# Altium schematic sheet GPRSshield v1.4_1.SchDoc
size 291 x 204 mm
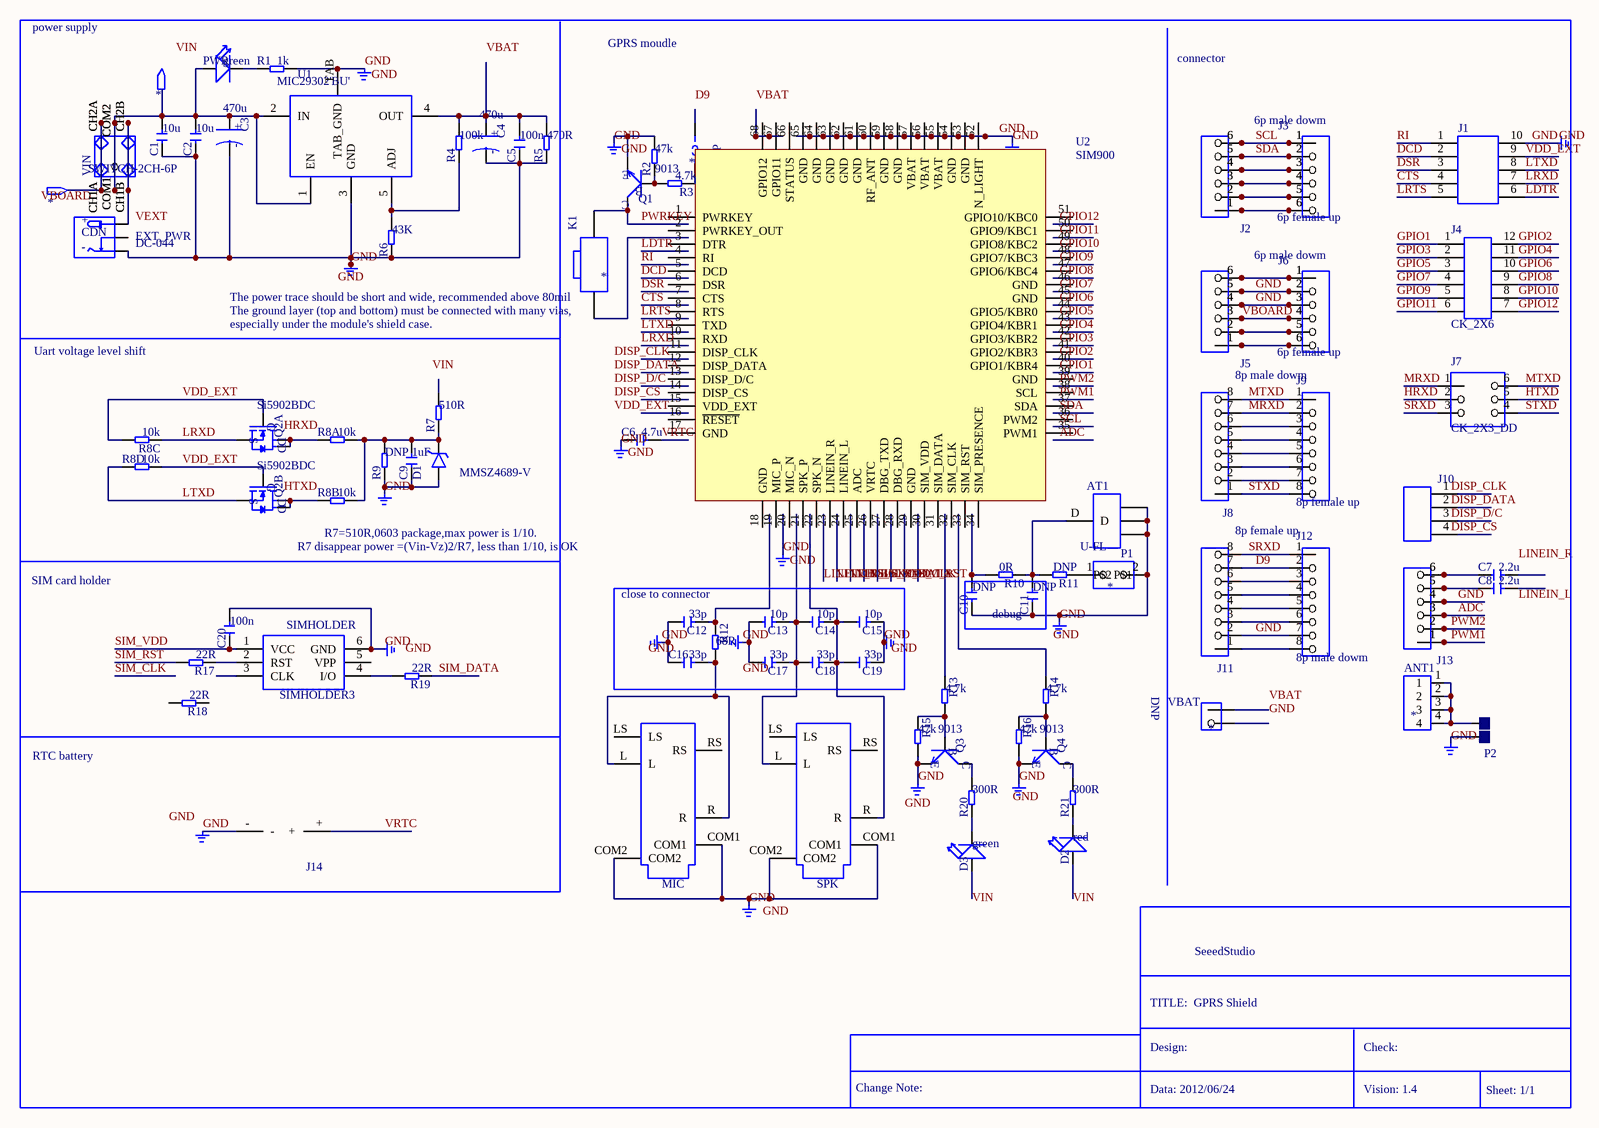
[diagram p0: GPRSshield v1.4_1.SchDoc]

## Parts
ANT1  *  [SMA-TO-IPX]
AT1  U-FL  [4P-U-FL]
C1  10u  [0603]
C2  10u  [0603]
C3  470u  [AVX_D]
C4  470u  [AVX_D]
C5  100n  [0603]
C6  4.7u  [0805]
C7  2.2u  [0603]
C8  2.2u  [0603]
C9  1uF  [0603]
C10  DNP  [0402]
C11  DNP  [0402]
C12  33p  [0603]
C13  10p  [0402]
C14  10p  [0402]
C15  10p  [0402]
C16  33p  [0603]
C17  33p  [0402]
C18  33p  [0402]
C19  33p  [0402]
C20  100n  [0603]
D1  MMSZ4689-V  [SOD123-2.7X1.6]
D2  red  [LED-0603]
D3  green  [LED-0603]
EXT_PWR  DC-044  [DC-404]
J1  (no value)  [2X5P-2.54]
J2  6p male dowm  [CK_1X6]
J3  6p female up  [CK_1X6]
J4  CK_2X6  [CK_2X6]
J5  6p male dowm  [CK_1X6]
J6  6p female up  [CK_1X6]
J7  CK_2X3_DD  [CK_2X3]
J8  8p male dowm  [CK_1X8]
J9  8p female up  [CK_1X8]
J10  (no value)  [4P-2.54-90D-FEMALE]
J11  8p female up  [CK_1X8]
J12  8p male dowm  [CK_1X8]
J13  (no value)  [CK_1X6]
J14  (no value)  [CR1220]
JP  *  [2P-SMD-3.3X2]
K1  *  [BTN_5.0_RST]
MIC  (no value)  [3.5-SMD]
P1  *  [JP]
P2  *  [2P-SMD-1.78X1.27]
PWR  green  [D0603]
Q1  9013  [SOT23]
Q2  Si5902BDC  [1206-8]  (parts A,B of 2)
Q3  9013  [SOT23]
Q4  9013  [SOT23]
R1  1k  [0603]
R2  47k  [0603]
R3  4.7k  [0603]
R4  100k  [0603]
R5  470R  [0603]
R6  43K  [0603]
R7  510R  [0603]
R8  10k  [1206-8-3.3X2.4]  (parts A,B,C,D of 4)
R9  DNP  [0603]
R10  0R  [0402]
R11  DNP  [0402]
R12  68R  [0603]
R13  4.7k  [0603]
R14  4.7k  [0603]
R15  47k  [0603]
R16  47k  [0603]
R17  22R  [0603]
R18  22R  [0603]
R19  22R  [0603]
R20  300R  [0603]
R21  300R  [0603]
SIMHOLDER  SIMHOLDER3  [SIMHOLDER3]
SPK  (no value)  [3.5-SMD]
U1  MIC29302'BU'  [TO-263]
U2  SIM900  [SIM900]
U$1  *
U$2  (no value)
U$3  (no value)
U$4  (no value)
U$5  (no value)
U$6  (no value)
U$7  (no value)
U$8  (no value)
U$12  (no value)
U$13  (no value)
U$14  (no value)
U$15  (no value)
U$16  (no value)
U$17  (no value)
U$18  (no value)
U$19  (no value)
U$20  (no value)
U$21  (no value)
U$22  (no value)
U$23  *
VBAT  *  [CK_1*2]
VIN  SWITCH-2CH-6P  [6P-2CH-2.54-7.6X3.0]

## Blocks framed on the sheet
close to connector: C12-C19 R12 U$14 U$15 U$20
debug: C10 C11

## Nets
ADC: J13.3
CTS: J1.4
D9: J11.7(P$7) J12.2(P$2)
DCD: J1.2
DSR: J1.3
GND: AT1.GND1 AT1.GND2 AT1.GND3 C1.1 C2.1 C3.- C4.- C5.1 C6.1 C9.1 C10.1 C11.1 C12.2 C13.2 C15.1 C16.1 C17.2 C19.1 C20.2 D1.1 EXT_PWR.- J1.10 J5.4 J5.5 J6.2 J6.3 J11.2(P$2) J12.7(P$7) J13.4 J14.- MIC.COM1 MIC.COM2 P1.2(P$2) P2.2 Q1.2(E) Q3.2(E) Q4.2(E) R1.2 R2.2 R5.1 R6.1 R9.1 R15.2 R16.2 SIMHOLDER.6(GND) SPK.COM1 SPK.COM2 U1.3(GND) U1.TAB(TAB_GND) U$2.0(GND) U$3.0(GND) U$4.0(GND) U$5.0(GND) U$6.0(GND) U$7.0(GND) U$8.0(GND) U$12.0(GND) U$13.0(GND) U$14.0(GND) U$15.0(GND) U$16.0(GND) U$17.0(GND) U$18.0(GND) U$19.0(GND) U$20.0(GND) U$21.0(GND) U$22.0(GND)
GPIO1: J4.1
GPIO2: J4.12
GPIO3: J4.2
GPIO4: J4.11
GPIO5: J4.3
GPIO6: J4.10
GPIO7: J4.4
GPIO8: J4.9
GPIO9: J4.5
GPIO10: J4.8
GPIO11: J4.6
GPIO12: J4.7
HRXD: J7.2
HTXD: J7.5
LDTR: J1.6
LRTS: J1.5
LRXD: J1.7 Q2.1(S) R8.3
LTXD: J1.8 Q2.3(S) R8.4
MRXD: J7.1 J8.7(P$7) J9.2(P$2)
MTXD: J7.6 J8.8(P$8) J9.1(P$1)
PWM1: J13.1
PWM2: J13.2
PWRKEY: K1.P$2 Q1.3(C)
RI: J1.1
SCL: J2.6 J3.1
SDA: J2.5 J3.2
SIM_DATA: R19.1
SIM_RST: R17.2
SIM_VDD: C20.1 SIMHOLDER.1(VCC)
SRXD: J7.3 J11.8(P$8) J12.1(P$1)
STXD: J7.4 J8.1(P$1) J9.8(P$8)
VBOARD: J5.3 J6.4
VDD_EXT: J1.9 Q2.2(G) Q2.4(G) R8.5 R8.6
VRTC: C6.2 J14.+
NetANT1_1: ANT1.1 ANT1.2 ANT1.3 ANT1.4 P2.1
NetAT1_D: AT1.D C11.2 R10.1 R11.2
NetC1_2: C1.2 C2.2 C3.+ PWR.+ U1.1(EN) U1.2(IN) VIN.COM1 VIN.COM2
NetC4_+: C4.+ C5.2 R4.2 R5.2 U1.4(OUT)
NetC7_1: C7.1 J13.6
NetC8_1: C8.1 J13.5
NetC9_2: C9.2 D1.2 R7.1 R8.7 R8.8 R9.2
NetC10_2: C10.2 R10.2
NetC12_1: C12.1 R12.1
NetC13_1: C13.1 C14.2 C17.1 C18.2 SPK.L
NetC14_1: C14.1 C15.2 C18.1 C19.2 SPK.R
NetC16_2: C16.2 MIC.L MIC.R R12.2
NetD2_-: D2.- R21.1
NetD3_-: D3.- R20.1
NetEXT_PWR_+: EXT_PWR.+ VIN.CH1B VIN.CH2B
NetJ2_1: J2.1 J3.6
NetJ2_2: J2.2 J3.5
NetJ2_3: J2.3 J3.4
NetJ2_4: J2.4 J3.3
NetJ5_1: J5.1 J6.6
NetJ5_2: J5.2 J6.5
NetJ5_6: J5.6 J6.1
NetJ8_2: J8.2(P$2) J9.7(P$7)
NetJ8_3: J8.3(P$3) J9.6(P$6)
NetJ8_4: J8.4(P$4) J9.5(P$5)
NetJ8_5: J8.5(P$5) J9.4(P$4)
NetJ8_6: J8.6(P$6) J9.3(P$3)
NetJ11_1: J11.1(P$1) J12.8(P$8)
NetJ11_3: J11.3(P$3) J12.6(P$6)
NetJ11_4: J11.4(P$4) J12.5(P$5)
NetJ11_5: J11.5(P$5) J12.4(P$4)
NetJ11_6: J11.6(P$6) J12.3(P$3)
NetJP_2: JP.2 R3.1
NetP1_1: P1.1(P$1) R11.1
NetPWR_-: PWR.- R1.1
NetQ1_1: Q1.1(B) R2.1 R3.2
NetQ2_5: Q2.5(D@1) Q2.6(D@2) R8.2
NetQ2_7: Q2.7(D@1) Q2.8(D@2) R8.1
NetQ3_1: Q3.1(B) R13.2 R15.1
NetQ3_3: Q3.3(C) R20.2
NetQ4_1: Q4.1(B) R14.2 R16.1
NetQ4_3: Q4.3(C) R21.2
NetR4_1: R4.1 R6.2 U1.5(ADJ)
NetR17_1: R17.1 SIMHOLDER.2(RST)
NetR19_2: R19.2 SIMHOLDER.4(I/O)
NetVIN_CH1A: VIN.CH1A VIN.CH2A

Not connected (* = marked no-connect by the designer): C7 2; C8 2; D2 +; D3 +; EXT_PWR CDN; J10 1(P$1) 2(P$2) 3(P$3) 4(P$4); JP 1; K1 P$1(1); MIC LS RS; R7 2; R13 1; R14 1; R18 1 2; SIMHOLDER 3(CLK) 5(VPP); SPK LS RS; U2 1(PWRKEY) 2(PWRKEY_OUT) 3(DTR) 4(RI) 5(DCD) 6(DSR) 7(CTS) 8(RTS) 9(TXD) 10(RXD) 11(DISP_CLK) 12(DISP_DATA) 13(DISP_D/C) 14(DISP_CS) 15(VDD_EXT) 16(~{RESET}) 17(GND) 18(GND) 19(MIC_P) 20(MIC_N) 21(SPK_P) 22(SPK_N) 23(LINEIN_R) 24(LINEIN_L) 25(ADC) 26(VRTC) 27(DBG_TXD) 28(DBG_RXD) 29(GND) 30(SIM_VDD) 31(SIM_DATA) 32(SIM_CLK) 33(SIM_RST) 34(SIM_PRESENCE) 35(PWM1) 36(PWM2) 37(SDA) 38(SCL) 39(GND) 40(GPIO1/KBR4) 41(GPIO2/KBR3) 42(GPIO3/KBR2) 43(GPIO4/KBR1) 44(GPIO5/KBR0) 45(GND) 46(GND) 47(GPIO6/KBC4) 48(GPIO7/KBC3) 49(GPIO8/KBC2) 50(GPIO9/KBC1) 51(GPIO10/KBC0) 52(N_LIGHT) 53(GND) 54(GND) 55(VBAT) 56(VBAT) 57(VBAT) 58(GND) 59(GND) 60(RF_ANT) 61(GND) 62(GND) 63(GND) 64(GND) 65(GND) 66(STATUS) 67(GPIO11) 68(GPIO12); VBAT 1 2

## Notes on the sheet
- power supply
- GPRS moudle
- connector
- (near K1) The power trace should be short and wide, recommended above 80mil
- (near K1) The ground layer (top and bottom) must be connected with many vias,
- especially under the module's shield case.
- Uart voltage level shift
- SIM card holder
- R7 disappear power =(Vin-Vz)2/R7, less than 1/10, is OK
- R7=510R,0603 package,max power is 1/10.
- RTC battery
- SeeedStudio
- TITLE:  GPRS Shield
- Design:
- Check:
- Change Note:
- Data: 2012/06/24
- Vision: 1.4
- Sheet: 1/1
- Labels drawn without touching a wire or pin: D9, DISP_CLK, DISP_CS, DISP_D/C, DISP_DATA, GND, HRXD, HTXD, LINEIN_L, LINEIN_R, VBAT, VBOARD, VDD_EXT, VEXT, VIN
- (in symbol 010-DUAL-N-MOSFET_1206-8, part A) D
- (in symbol 010-DUAL-N-MOSFET_1206-8, part B) D
- (in symbol HEADER_1X2_2.54) DNP

## Library data of the parts
ANT1 = ANTENNA-SMA-IPX
AT1 = ANTENNA-U-FL
C1 C2 C5 C7-C9 C12 C16 C20 = C-0603
C3 C4 = 006-CAP_AVX_D
C6 = C-0805
C10 C11 C13-C15 C17-C19 = C-0402
D1 = D-VOL'MMSZ4681'
D2 D3 = LED'0603'
J1 = HEADER-2X5P-2.54
J2 J3 J5 J6 J13 = HEADER_1X6
J8 J9 J11 J12 = CK_1X8DD
J10 = HEADER-4P'2.54-90D-FEMALE'
J14 = HOLDER-BATTERY-2P-CR1220
JP = PAD-SOLDERJUMPERNC
K1 = BOTTON_1_DP
MIC SPK = AUDIO-SMT
P1 = JP
P2 = PAD-JUMPER-2P
PWR = 007-LED0603
Q1 Q3 Q4 = TRANSISTOR-NPN-SOT23
Q2 = 010-DUAL-N-MOSFET_1206-8
R1-R7 R9 R12-R21 = R-0603
R8 = R-4R-1206
R10 R11 = R-0402
U$1 U$23 = SINGLE-PIN
U$2-U$8 U$12-U$22 = GND_POWER
VBAT = HEADER_1X2_2.54